# EAGLE design ATTINYProgrammer (EAGLE 6.3)
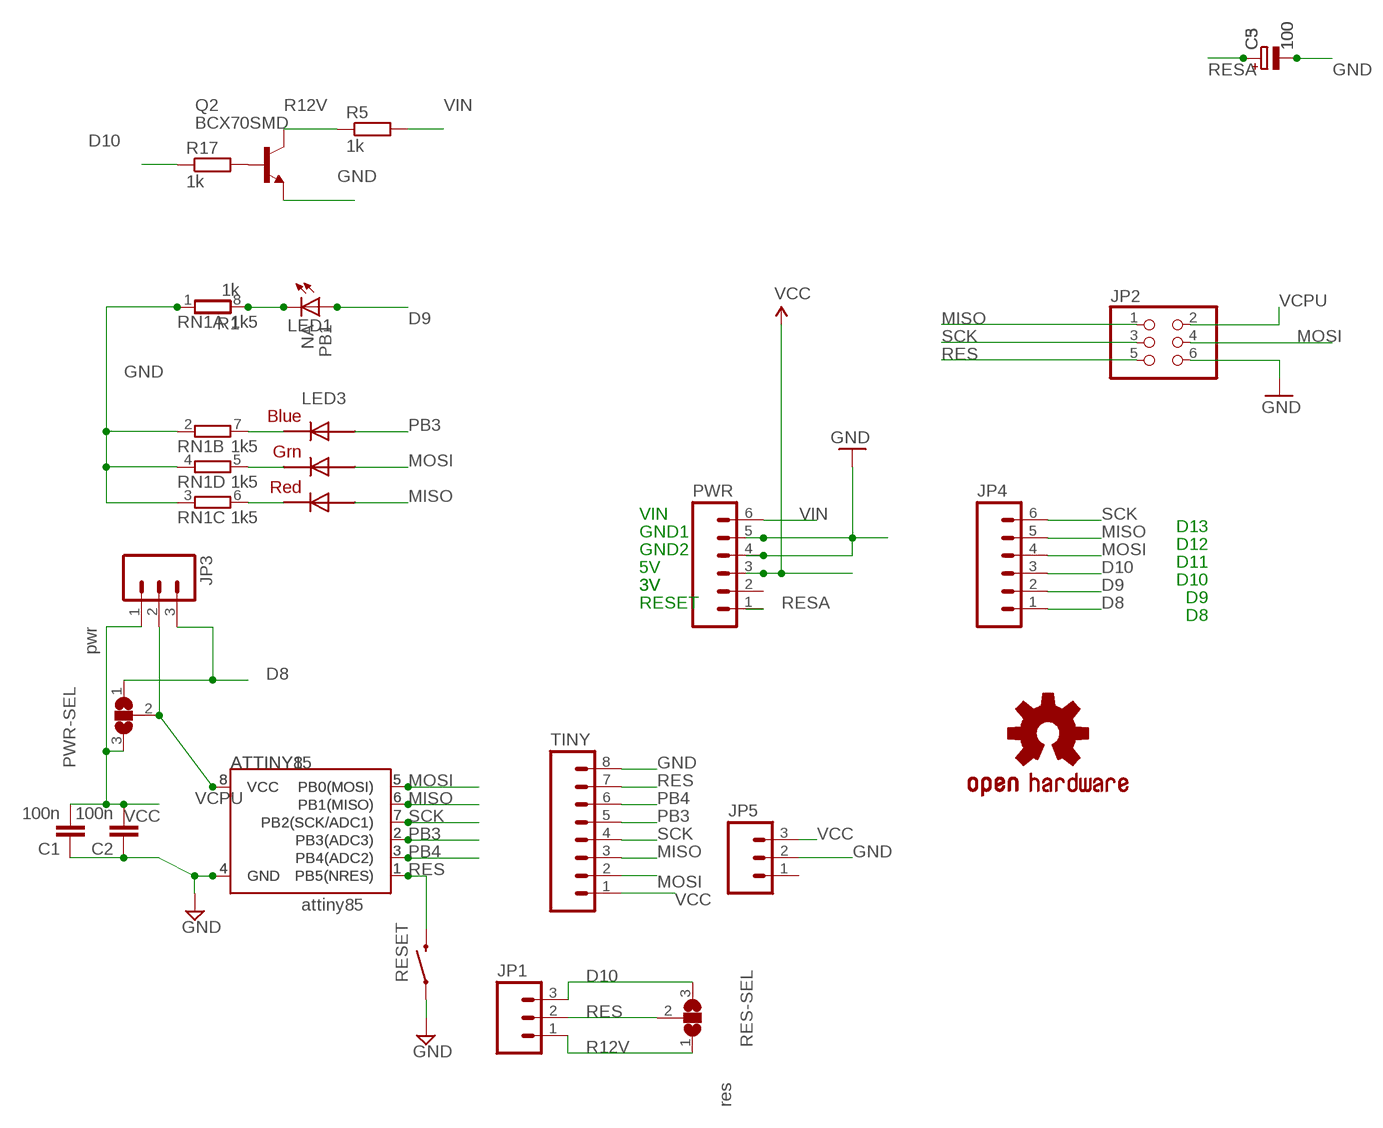
[diagram p0: schematic, sheet 1]

## Parts
ATTINY1  ATTINY45  [SO08-EIAJ]
ATTINY85  ATTINY45DIP8  [DIP08]
C1  100n  C-EUC0603  [C0603]
C2  100n  C-EU025-024X044  [C025-024X044]
C3  100  CPOL-EUTT2D4  [TT2D4]
C5  100  CPOL-EU153CLV-0405  [153CLV-0405]
JP1  M03PTH  [1X03]
JP2  PINHD-2X3  [2X03]
JP3  M03PTH  [1X03]
JP4  M06LOCK  [1X06_LOCK]
JP5  M03LOCK  [1X03_LOCK]
LED1  LED3MM  [LED3MM]
LED3  RGBLED5050  [RGBLED5050]
PB1  NA  LED0603DWS  [LED-0603]
PWR  M06LOCK  [1X06_LOCK]
PWR-SEL  pwr  SJ2W3  [SJ_2_SMALL]
Q2  BCX70SMD  [SOT23]
R1  1k  R-EU_0204/5  [0204/5@1]
R5  1k  R-EU_R0603  [R0603]
R17  1k  R-EU_R0603  [R0603]
RES-SEL  res  SJ2W3  [SJ_2_SMALL]
RESET  SWITCH-MOMENTARY-2-SMD-1101NE  [TACTILE-SWITCH-1101NE]
RN1  1k5  4R-N0603-ARC  [0603-ARC]
TINY  M08LOCK  [1X08_LOCK]
U$2  OSHW-LOGOS  [OSHW-LOGO-S]

## Nets
D8: JP3.3 JP4.1 PWR-SEL.1
D9: JP4.2 LED1.A PB1.A
D10: JP1.3 JP4.3 R17.1 RES-SEL.3
GND: ATTINY1.4(GND) ATTINY85.4(GND) C1.1 C2.1 C3.- C5.- JP2.6 JP5.2 PWR.4 PWR.5 Q2.2(E) R1.2 RESET.P$1 RN1.1 RN1.2 RN1.3 RN1.4 TINY.8
MISO: ATTINY1.6(PB1(MISO)) ATTINY85.6(PB1(MISO)) JP2.1 JP4.5 LED3.2(RED_A) TINY.3
MOSI: ATTINY1.5(PB0(MOSI)) ATTINY85.5(PB0(MOSI)) JP2.4 JP4.4 LED3.1(GREEN_A) TINY.2
N$1: LED1.K(C) PB1.C R1.1 RN1.8
N$2: LED3.4(BLUE_C) RN1.7
N$3: LED3.6(GREEN_C) RN1.5
N$6: Q2.1(B) R17.2
N$11: LED3.5(RED_C) RN1.6
PB3: ATTINY1.2(PB3(ADC3)) ATTINY85.2(PB3(ADC3)) LED3.3(BLUE_A) TINY.5
PB4: ATTINY1.3(PB4(ADC2)) ATTINY85.3(PB4(ADC2)) TINY.6
R12V: JP1.1 Q2.3(C) R5.1 RES-SEL.1
RES: ATTINY1.1(PB5(NRES)) ATTINY85.1(PB5(NRES)) JP1.2 JP2.5 RES-SEL.2 RESET.P$2 TINY.7
RESA: C3.+ C5.+ PWR.1
SCK: ATTINY1.7(PB2(SCK/ADC1)) ATTINY85.7(PB2(SCK/ADC1)) JP2.3 JP4.6 TINY.4
VCC: C1.2 C2.2 JP3.1 JP5.3 PWR-SEL.3 PWR.3 TINY.1
VCPU: ATTINY1.8(VCC) ATTINY85.8(VCC) JP2.2 JP3.2 PWR-SEL.2
VIN: PWR.6 R5.2
Unconnected: JP5.1 PWR.2

## Notes on the sheet
- VIN | D13
- GND1 | D12
- GND2 | D11
- 5V | D10
- 3V | 3V | D9
- RESET | D8
- attiny85

## Library data of the parts
ATTINY1 ATTINY85 = SparkFun:ATTINY45: Atmel ATTiny45
C1 C2 = rcl:C-EU: CAPACITOR, European symbol
C3 C5 = resistor:CPOL-EU: POLARIZED CAPACITOR, European symbol
JP1 JP3 JP5 = SparkFun:M03: Header 3 Standard 3-pin 0.1" header. Use with straight break away headers (SKU : PRT-00116), right angle break away headers (PRT-00553), swiss pins (PRT-00743), machine pins (PRT-00117), and female headers (PRT-00115). Molex polarized connector foot print use with SKU : PRT-08232 with associated crimp pins and housings.
JP2 = pinhead:PINHD-2X3: PIN HEADER
JP4 PWR = SparkFun:M06: Header 6 Standard 6-pin 0.1" header. Use with straight break away headers (SKU : PRT-00116), right angle break away headers (PRT-00553), swiss pins (PRT-00743), machine pins (PRT-00117), and female headers (PRT-00115). Molex polarized connector foot print use with SKU : PRT-08094 with associated crimp pins and housings. NOTES ON THE VARIANTS LOCK and LOCK_LONGPADS... This footprint was designed to help hold the alignment of a through-hole component (i.e. 6-pin header) while soldering it into place. You may notice that each hole has been shifted either up or down by 0.005 of an inch from it's more standard position (which is a perfectly straight line). This slight alteration caused the pins (the squares in the middle) to touch the edges of the holes. Because they are alternating, it causes a "brace" to hold the component in place. 0.005 has proven to be the perfect amount of "off-center" position when using our standard breakaway headers. Although looks a little odd when you look at the bare footprint, once you have a header in there, the alteration is very hard to notice. Also, if you push a header all the way into place, it is covered up entirely on the bottom side. This idea of altering the position of holes to aid alignment will be further integrated into the Sparkfun Library for other footprints. It can help hold any component with 3 or more connection pins.
LED1 = adafruit:LED: LED OSRAM: - CHIPLED LG R971, LG N971, LY N971, LG Q971, LY Q971, LO R971, LY R971 LH N974, LH R974 LS Q976, LO Q976, LY Q976 LO Q996 - Hyper CHIPLED LW Q18S LB Q993, LB Q99A, LB R99A - SideLED LS A670, LO A670, LY A670, LG A670, LP A670 LB A673, LV A673, LT A673, LW A673 LH A674 LY A675 LS A676, LA A676, LO A676, LY A676, LW A676 LS A679, LY A679, LG A679 - Hyper Micro SIDELED® LS Y876, LA Y876, LO Y876, LY Y876 LT Y87S - SmartLED LW L88C, LW L88S LB L89C, LB L89S, LG L890 LS L89K, LO L89K, LY L89K LS L896, LA L896, LO L896, LY L896 - TOPLED LS T670, LO T670, LY T670, LG T670, LP T670 LSG T670, LSP T670, LSY T670, LOP T670, LYG T670 LG T671, LOG T671, LSG T671 LB T673, LV T673, LT T673, LW T673 LH T674 LS T676, LA T676, LO T676, LY T676, LB T676, LH T676, LSB T676, LW T676 LB T67C, LV T67C, LT T67C, LS T67K, LO T67K, LY T67K, LW E67C LS E67B, LA E67B, LO E67B, LY E67B, LB E67C, LV E67C, LT E67C LW T67C LS T679, LY T679, LG T679 LS T770, LO T770, LY T770, LG T770, LP T770 LB T773, LV T773, LT T773, LW T773 LH T774 LS E675, LA E675, LY E675, LS T675 LS T776, LA T776, LO T776, LY T776, LB T776 LHGB T686 LT T68C, LB T68C - Hyper Mini TOPLED® LB M676 - Mini TOPLED Santana® LG M470 LS M47K, LO M47K, LY M47K Source: http://www.osram.convergy.de/
LED3 = adafruit:RGBLED: For 5050 RGB LEDs, the order of the LEDs may vary from one manufacturer to another!
PB1 = DOUBLE-SIDE:LED
PWR-SEL RES-SEL = jumper:SJ2W: SMD solder JUMPER
Q2 = transistor-npn:BCX70*: NPN Transistor
R1 R5 R17 = rcl:R-EU_: RESISTOR, European symbol
RESET = SparkFun:SWITCH-MOMENTARY-2
RN1 = resistor-dil:4R-N: Array Chip Resistor Source: RS Component / Phycomp; OC_FARNELL: unknown; OC_NEWARK: unknown
TINY = SparkFun:M08: Header 8 Standard 8-pin 0.1" header. Use with straight break away headers (SKU : PRT-00116), right angle break away headers (PRT-00553), swiss pins (PRT-00743), machine pins (PRT-00117), and female headers (PRT-00115).
U$2 = SparkFun:OSHW-LOGO: Open Source Hardware Logo This logo indicates the piece of hardware it is found on incorporates a OSHW license and/or adheres to the definition of open source hardware found here: http://freedomdefined.org/OSHW

## Net classes
0 default: width 0.229 mm, drill 0.356 mm, clearance 0.229 mm
1 GND: width 0.229 mm, drill 0.356 mm, clearance 0.229 mm
2 pwr: width 0.229 mm, drill 0.356 mm, clearance 0.229 mm

## Board
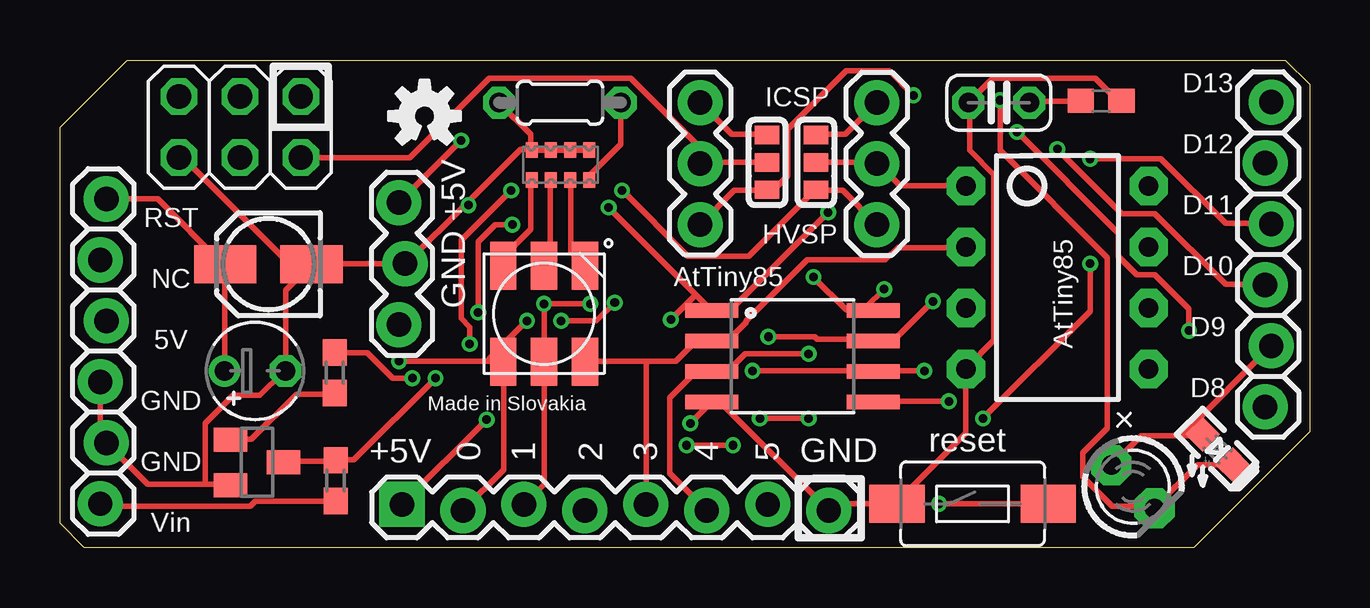
[diagram p1: board, top side]
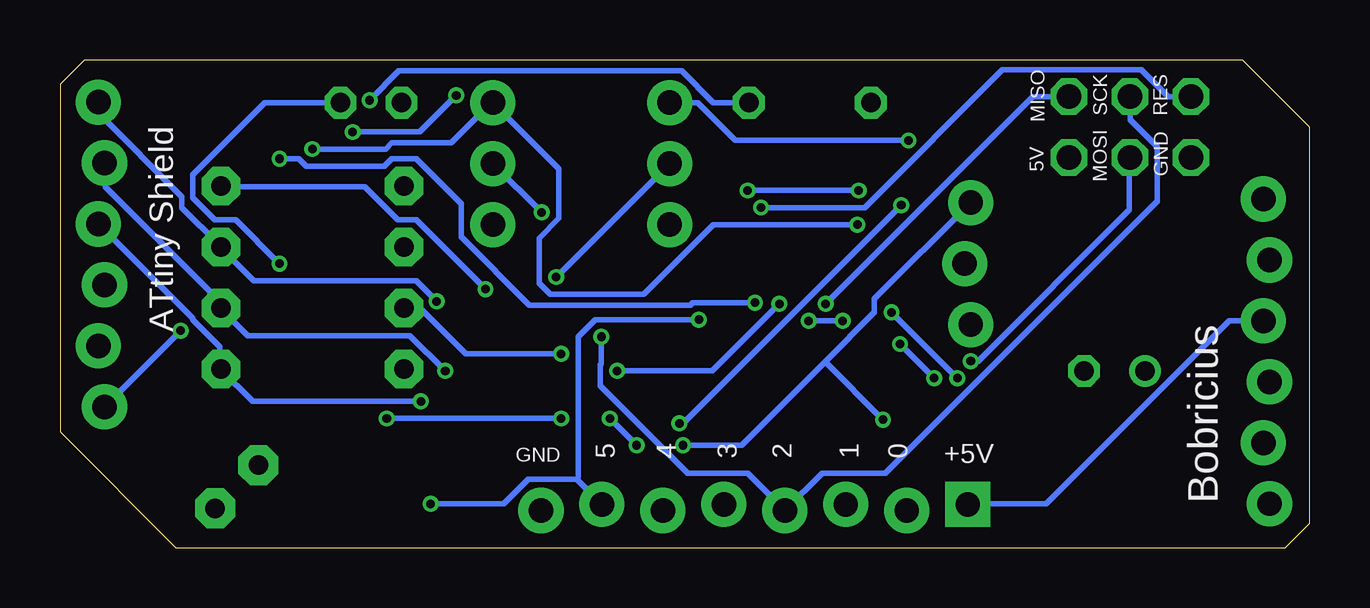
[diagram p2: board, bottom side, seen from below]

Size 52.07 x 20.32 mm. Coordinates in mm from the lower left corner, seen from the top.
Outline: 0,1.02 0,17.53 2.79,20.32 51.05,20.32 52.07,19.3 52.07,4.83 47.24,0 1.02,0 0,1.02
Copper layers (1*16): Top 0.035mm / dielectric 1.5mm / Bottom 0.035mm
Design rules "ITEADstudio_DRC": minimum track width 6mil, minimum drill 12mil, track to track 6mil, track to pad 6mil, pad to pad 6mil, via to via 6mil, smd to smd 0mil, copper to edge 10mil, drill to drill 10mil, minimum pad ring 10mil, minimum via ring 6mil, stop-mask expansion 2mil, vias tented up to drill 100mil, thermal gap 10mil

### Footprints (pad centres in the part's own frame; a part is rotated, then mirrored left to right if it is on the bottom)
SO08-EIAJ = smd 0.61 x 2.21: 1 -1.905,-3.378; 2 -0.635,-3.378; 3 0.635,-3.378; 4 1.905,-3.378; 5 1.905,3.353; 6 0.635,3.353; 7 -0.635,3.353; 8 -1.905,3.353
DIP08 = drill 0.813 pad 1.6 octagon: 1 -3.81,-3.81; 2 -1.27,-3.81; 3 1.27,-3.81; 4 3.81,-3.81; 5 3.81,3.81; 6 1.27,3.81; 7 -1.27,3.81; 8 -3.81,3.81
C0603 = smd 1.1 x 1: 1 -0.85,0; 2 0.85,0
C025-024X044 = drill 0.813 octagon: 1 -1.27,0; 2 1.27,0
TT2D4 = drill 0.813: + -1.27,0 | drill 0.813 octagon: - 1.27,0
153CLV-0405 = smd 2.6 x 1.6: + 1.8,0; - -1.8,0
1X03 = drill 1.016 pad 1.88: 1 0,0; 2 2.54,0; 3 5.08,0
2X03 = drill 1.016 octagon: 1 -2.54,-1.27; 2 -2.54,1.27; 3 0,-1.27; 4 0,1.27; 5 2.54,-1.27; 6 2.54,1.27
1X06_LOCK = drill 1.016 pad 1.88: 1 0,0; 2 2.54,-0.254; 3 5.08,0; 4 7.62,-0.254; 5 10.16,0; 6 12.7,-0.254
1X03_LOCK = drill 1.016 pad 1.88: 1 0,0.127; 2 2.54,-0.127; 3 5.08,0.127
LED3MM = drill 0.813 pad 1.676 octagon: A -1.27,0; K 1.27,0
RGBLED5050 = smd 2 x 1.1: 1 -2,1.7; 2 -2,0; 3 -2,-1.7; 4 2,-1.7; 5 2,0; 6 2,1.7
LED-0603 = smd 1.016 x 1.016: A 0.889,0; C -0.889,0
SJ_2_SMALL = smd 0.762 x 1.016: 1 -1.143,0; 2 0,0; 3 1.143,0
SOT23 = smd 1 x 1.4: 1 -0.95,-1.1; 2 0.95,-1.1; 3 0,1.1
0204/5@1 = drill 0.813 octagon: 1 -2.54,0; 2 2.54,0
R0603 = smd 1.1 x 1: 1 -0.85,0; 2 0.85,0
TACTILE-SWITCH-1101NE = smd 2.3 x 1.6: P$1 -3.15,0; P$2 3.15,0
0603-ARC = smd 0.5 x 0.65: 1 -1.2,-0.625; 2 -0.4,-0.625; 3 0.4,-0.625; 4 1.2,-0.625; 5 1.2,0.625; 6 0.4,0.625; 7 -0.4,0.625; 8 -1.2,0.625
1X08_LOCK = drill 1.016 pad 1.88 square: 1 0,0.127 | drill 1.016 pad 1.88: 2 2.54,-0.127; 3 5.08,0.127; 4 7.62,-0.127; 5 10.16,0.127; 6 12.7,-0.127; 7 15.24,0.127; 8 17.78,-0.127

### Placement (x,y rotation side)
ATTINY1  30.53,7.98 270 top
ATTINY85  41.55,11.25 270 top
C1  43.38,18.62 180 top
C2  39.12,18.54 0 top
C3  8.13,7.37 0 top
C5  8.69,11.81 180 top
JP1  34.04,13.46 90 top
JP2  7.49,17.53 180 top
JP3  26.67,18.54 270 top
JP4  50.22,5.87 90 top
JP5  14.25,9.3 90 top
LED1  44.7,2.54 315 top
LED3  20.17,9.75 90 top
PB1  48.23,4.09 135 top
PWR  1.93,14.53 270 top
PWR-SEL  29.46,16.05 90 top
Q2  8.2,3.56 270 top
R1  20.83,18.54 180 top
R5  11.48,2.79 270 top
R17  11.46,7.29 270 top
RES-SEL  31.5,16.05 90 top
RESET  38.02,1.83 0 top
RN1  20.85,15.95 180 top
TINY  14.25,1.68 0 top
U$2  15.19,17.98 0 top

### Tracks (layer width: path | path; a pad name or v marks a point on that pad's centre or on a via)
D8  (via drill 0.36)
  Top 0.229: JP3.3 28.09,14.88 29.46,14.88 PWR-SEL.1 29.57,14.94 29.77,14.94 30.33,15.49 30.33,17.42 32.77,19.86 34.54,19.86 v35.56,18.85 | v47.04,9.04 47.04,9.96 45.62,11.38 44.86,11.38 44.09,12.14 44.09,13.11 v39.88,17.32
  Bottom 0.229: v47.04,9.04 JP4.1 | v39.88,17.32 37.08,17.32 v35.56,18.85
D9
  Top 0.229: 47.65,4.72 PB1.A 47.5,4.67 46.84,4.67 | 46.84,4.67 45.06,4.67 43.84,3.45 LED1.A | JP4.2 46.84,4.77 46.84,4.67
D10  (via drill 0.36)
  Top 0.229: JP1.3 32.72,17.22 31.5,17.22 RES-SEL.3 | v14.68,7.06 13.87,7.06 12.8,8.13 11.48,8.13 R17.1 | v17.42,9.8 17.42,12.75 18.14,13.46 v18.85,13.46 | v41.55,16.61 44.25,13.92 45.62,13.92 48.57,10.97 50.19,10.97 JP4.3
  Bottom 0.229: v17.42,9.8 v14.68,7.06 | v18.85,13.46 24.84,13.46 27.74,10.57 31.65,10.57 32.11,11.02 32.11,12.9 31.29,13.72 31.29,15.8 JP1.3 34.14,18.49 35.76,16.87 38.25,16.87 38.51,16.61 v41.55,16.61
GND  (via drill 0.36)
  Top 0.229: C1.1 44.2,18.64 44.04,18.64 43.13,19.56 38.86,19.56 C2.1 37.9,18.44 37.9,16.56 38.91,15.54 38.91,8.64 37.8,7.52 ATTINY85.4 37.74,4.77 34.9,1.93 RESET.P$1 31.9,1.83 TINY.8 27.53,6.05 27.18,6.05 ATTINY1.4 v26.26,5.18 | 6.04,2.64 3.66,2.64 PWR.5 1.88,4.47 1.68,4.67 PWR.4 | 6.04,2.64 7.06,2.64 Q2.2 | RN1.4 19.66,16.56 20.42,16.56 RN1.3 20.52,16.56 21.23,16.56 RN1.2 21.34,16.56 22.05,16.56 RN1.1 | R1.2 19.61,17.22 19.61,16.66 RN1.4 | C5.- 10.52,11.84 JP5.2 14.48,11.89 16.94,14.35 | C5.- 10.41,11.73 9.4,10.72 C3.- 9.3,7.32 8.33,6.35 7.21,6.35 6.04,5.18 6.04,2.64 | JP2.6 5.13,16.26 9.96,11.43 C5.- | 16.94,14.35 19.2,16.61 19.51,16.61 RN1.4 | v17.02,14.27 16.94,14.35
  Bottom 0.229: v26.26,5.18 26.11,5.18 v17.02,14.27
MISO  (via drill 0.36)
  Top 0.229: v36.02,7.37 33.88,7.37 ATTINY1.6 33.78,7.37 v28.85,7.37 | TINY.3 20.17,2.64 LED3.2 v20.17,10.16 v22.1,10.16
  Bottom 0.229: v36.02,7.37 37.49,8.84 44.25,8.84 45.36,9.96 ATTINY85.6 45.41,10.06 45.41,10.26 50.19,15.04 50.19,16 JP4.5 | JP2.1 11.53,18.8 v20.17,10.16 | v28.85,7.37 24.89,7.37 v22.1,10.16
MOSI  (via drill 0.36)
  Top 0.229: v37.03,6.1 33.88,6.1 ATTINY1.5 | TINY.2 18.49,3.25 18.49,7.72 LED3.1 18.39,7.77 17.88,7.77 | 17.88,7.77 v14.12,7.77 | v42.93,16.21 45.87,16.21 48.57,13.51 50.44,13.51 JP4.4 | v23.11,10.21 22.35,9.45 v20.88,9.45 | v19.46,9.45 17.88,7.87 17.88,7.77
  Bottom 0.229: v37.03,6.1 44.04,6.1 45.36,7.42 ATTINY85.5 45.41,7.52 45.41,8.38 46.53,9.5 46.53,9.55 JP4.4 | v14.12,7.77 13.82,7.77 7.52,14.07 7.52,16.26 JP2.4 | v42.93,16.21 42.11,16.21 41.81,15.9 38.56,15.9 38.25,16.21 37.24,16.21 35.36,14.33 35.36,12.95 32.51,10.11 25.81,10.11 25.71,10.21 v23.11,10.21 | v19.46,9.45 v20.88,9.45
N$1  (via drill 0.36)
  Top 0.229: R1.1 23.37,16.82 22.1,15.54 22.1,15.34 RN1.8 | PB1.C 48.82,3.45 47.4,3.45 45.62,1.68 LED1.K 45.52,1.73 43.84,1.73 42.62,2.95 42.62,3.96 43.64,4.98 43.64,12.09 39.17,16.56 v39.17,18.64
  Bottom 0.229: R1.1 24.84,18.54 26.16,19.86 37.95,19.86 v39.17,18.64
N$2
  Top 0.229: RN1.7 21.29,15.29 21.29,12.34 21.84,11.79 LED3.4
N$3
  Top 0.229: RN1.5 19.61,15.29 19.61,13.26 18.49,12.14 18.49,11.79 LED3.6
N$6
  Top 0.229: R17.2 11.43,6.4 9.86,6.4 7.98,4.52 7.11,4.52 Q2.1
N$11
  Top 0.229: RN1.6 20.42,15.29 20.42,12.04 20.17,11.79 LED3.5
PB3
  Top 0.229: 24.44,7.77 25.65,7.77 26.47,8.59 27.13,8.59 ATTINY1.2 27.23,8.69 27.89,8.69 28.6,9.4 28.6,9.45 31.14,11.99 34.39,11.99 34.9,12.5 37.74,12.5 ATTINY85.2 | 24.44,7.77 21.9,7.77 LED3.3 | 24.44,7.77 24.44,1.83 TINY.5
PB4  (via drill 0.36)
  Top 0.229: TINY.6 25.4,3.1 25.4,6.25 26.47,7.32 27.13,7.32 ATTINY1.3 27.23,7.42 27.89,7.42 28.55,8.08 v31.19,8.08
  Bottom 0.229: v31.19,8.08 35.15,8.08 37.03,9.96 37.74,9.96 ATTINY85.3
R12V  (via drill 0.36)
  Top 0.229: Q2.3 9.35,3.56 9.4,3.61 11.48,3.61 R5.1 11.58,3.66 12.24,3.66 v15.65,7.06 | JP1.1 32.61,14.88 31.5,14.88 RES-SEL.1 31.39,14.83 28.7,12.14 26.16,12.14 v23.42,14.88 | v17.07,8.48 17.07,9.2 16.71,9.55 16.71,12.8 v18.8,14.88
  Bottom 0.229: v17.07,8.48 v15.65,7.06 | v23.42,14.88 v18.8,14.88
RES  (via drill 0.36)
  Top 0.229: v36.63,1.83 RESET.P$2 | RES-SEL.2 33.98,16.05 JP1.2 34.14,15.95 35,15.09 37.74,15.09 ATTINY85.1 | v32,13.97 27.94,9.91 27.18,9.91 ATTINY1.1 26.49,10.54 | 26.49,10.54 v22.86,14.17 | 26.49,10.54 v25.45,9.5
  Bottom 0.229: v36.63,1.83 33.58,1.83 32.56,2.84 30.53,2.84 | TINY.7 30.53,2.84 | JP1.2 v32,13.97 | JP2.5 5.89,18.8 7.01,19.91 12.8,19.91 18.54,14.17 v22.86,14.17 | v25.45,9.5 29.77,9.5 30.48,8.79 30.48,2.95 30.53,2.84
RESA
  Top 0.229: C3.+ 6.86,11.79 C5.+ 6.76,11.84 4.06,14.53 PWR.1
SCK  (via drill 0.36)
  Top 0.229: v36.37,10.26 34.75,8.64 33.88,8.64 ATTINY1.7 33.78,8.69 31.55,8.69 31.45,8.79 v29.52,8.79
  Bottom 0.229: v36.37,10.26 37.24,11.12 43.99,11.12 45.36,12.5 ATTINY85.7 45.41,12.6 46.99,14.17 46.99,14.63 50.44,18.09 50.44,18.54 JP4.6 | JP2.3 7.47,18.8 7.47,17.83 6.35,16.71 6.35,14.43 17.68,3.1 20.32,3.1 TINY.4 23.42,3.1 25.91,3.1 29.57,6.76 29.57,7.62 29.52,7.67 v29.52,8.79
VCC  (via drill 0.36)
  Top 0.229: JP3.1 27.99,17.22 29.46,17.22 PWR-SEL.3 | C2.2 40.44,18.59 42.52,18.59 C1.2 | v42.93,11.84 42.93,9.86 v38.46,5.38 | v29.16,5.38 v31.19,5.38 | v26.11,4.27 v28.04,4.27 | JP5.3 v16.71,16.97 | v17.78,5.33 TINY.1
  Bottom 0.229: PWR.3 3.35,9.45 10.97,1.83 14.22,1.83 TINY.1 | C2.2 43.54,18.54 46.53,15.54 46.53,14.58 45.62,13.66 44.76,13.66 v42.93,11.84 | v31.19,5.38 v38.46,5.38 | v28.04,4.27 v29.16,5.38 | v26.11,4.27 23.67,4.27 20.19,7.75 | 20.19,7.75 18.14,9.8 18.14,10.36 JP5.3 | JP3.1 25.5,18.54 23.93,16.97 v16.71,16.97 | 20.19,7.75 v17.78,5.33
VCPU  (via drill 0.36)
  Top 0.229: PWR-SEL.2 26.72,16.05 JP3.2 27.18,16.15 23.77,19.56 17.88,19.56 14.58,16.26 JP2.2 | v31.39,11.28 32.77,9.91 33.88,9.91 ATTINY1.8 33.58,10.01 v34.34,10.77
  Bottom 0.229: JP3.2 v31.39,11.28 | v34.34,10.77 37.24,13.66 38,13.66 39.37,15.04 45.36,15.04 ATTINY85.8
VIN
  Top 0.229: PWR.6 1.78,1.73 7.92,1.73 8.13,1.93 11.48,1.93 R5.2

### Text on the board
tNames: D13 | ICSP | D12 | +5V | D11 | RST | HVSP | NC | AtTiny85 | D10 | GND | D9 | 5V | AtTiny85 | GND | Made in Slovakia | D8 | +5V | 0 | 1 | 2 | 3 | 4 | 5 | GND | reset | GND | Vin
bNames: RES | SCK | MISO | 5V | GND | MOSI | ATtiny Shield | +5V | 0 | 1 | 2 | 3 | 4 | 5 | GND | Bobricius